# Altium schematic sheet Current Mirror_2.SchDoc
size A4; SheetNumber: 4; SheetTotal: 4; SPICEModelCacheXGDUHXCS: <root> / <DocumentId>XGDUHXCS</DocumentId> / </root>
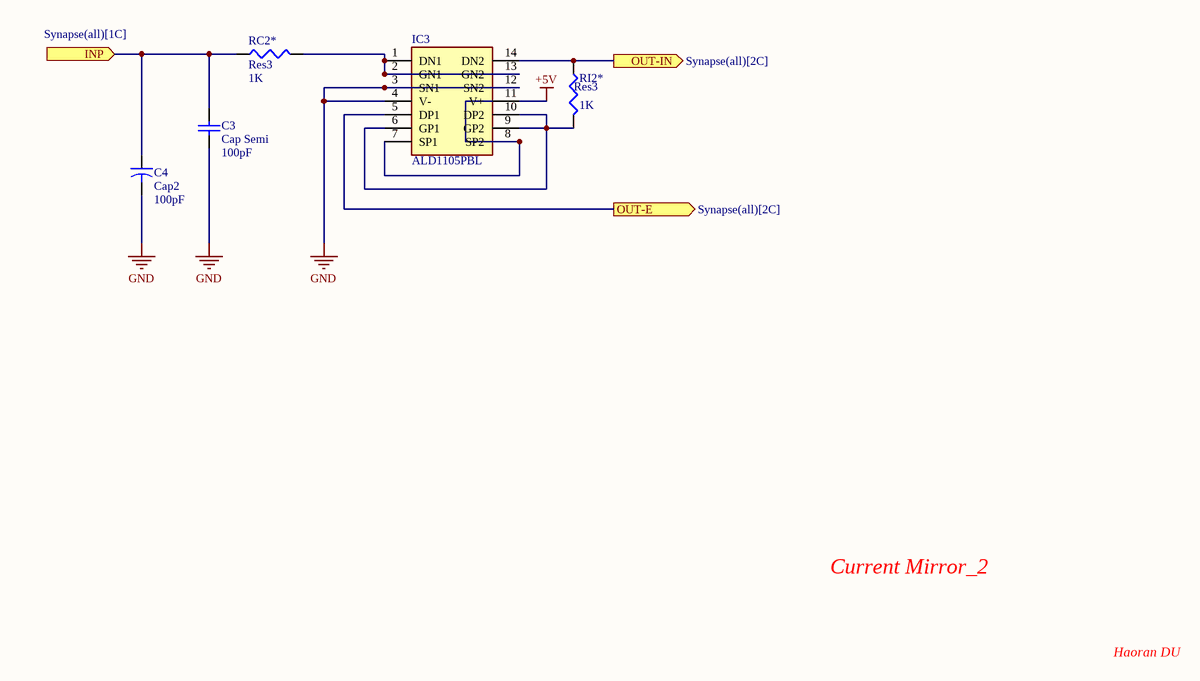
[diagram p0: Current Mirror_2.SchDoc]

## Parts
C3  Cap Semi  value 100pF  [C1206]
C4  Cap2  value 100pF  [CAPR5-4X5]
IC3  ALD1105PBL  [DIP762W51P254L1828H508Q14N]
RC2*  Res3  value 1K  [J1-0603]
RI2*  Res3  value 1K  [J1-0603]

## Ports
INP (in, see Synapse(all)[1C]), OUT-E (out, see Synapse(all)[2C]), OUT-IN (out, see Synapse(all)[2C])

## Nets
+5V: IC3.11(V+)
GND: C3.1 C4.2 IC3.3(SN1) IC3.4(V-) IC3.12(SN2)
INP: C3.2 C4.1 RC2*.1 ; port INP
OUT-E: IC3.5(DP1) ; port OUT-E
OUT-IN: IC3.14(DN2) RI2*.1 ; port OUT-IN
NetIC3_1: IC3.1(DN1) IC3.2(GN1) IC3.13(GN2) RC2*.2
NetIC3_6: IC3.6(GP1) IC3.9(GP2) IC3.10(DP2) RI2*.2
NetIC3_7: IC3.7(SP1) IC3.8(SP2)

## Notes on the sheet
- Current Mirror_2
- Haoran DU

## Library data of the parts
C3 = Cap Semi: Capacitor (Semiconductor SIM Model); Published: 8-Jun-2000; LatestRevisionDate: 29-May-2009; LatestRevisionNote: IPC-7351 Footprint Added.; PackageReference: C1206; Publisher: Altium Limited; PackageDescription: Chip Capacitor
C4 = Cap2: Capacitor; Published: 23-Sep-2002; PackageReference: CAPR5-4X5; Publisher: Altium Limited; PackageDescription: Capacitor; 2 Leads
IC3 = ALD1105PBL: Integrated Circuit; Manufacturer_Name: Advanced Linear Devices Inc.; Datasheet Link: https://www.mouser.es/datasheet/2/8/ALD1105-963896.pdf; Height: 5.08mm; Manufacturer_Part_Number: ALD1105PBL; Mouser Part Number: 585-ALD1105PBL; Mouser Price/Stock: https://www.mouser.co.uk/ProductDetail/Advanced-Linear-Devices/ALD1105PBL?qs=Du6x3Vjr3lUq%2FSLBVb98Ng%3D%3D
RC2* RI2* = Res3: Resistor; Published: 8-Jun-2000; LatestRevisionDate: 29-May-2009; LatestRevisionNote: IPC-7351 Footprint Added.; PackageReference: J1-0603; Publisher: Altium Limited; PackageDescription: Chip Resistor